# Altium schematic sheet Conectores.SchDoc
size A4
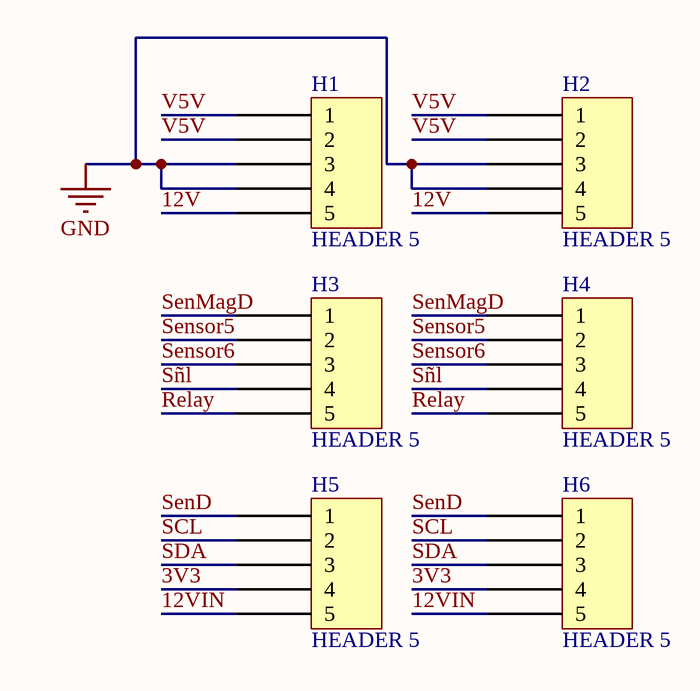
[diagram p0: Conectores.SchDoc]

## Parts
H1  HEADER 5  [HEADER5]
H2  HEADER 5  [HEADER5]
H3  HEADER 5  [HEADER5]
H4  HEADER 5  [HEADER5]
H5  HEADER 5  [HEADER5]
H6  HEADER 5  [HEADER5]

## Nets
GND: H1.3 H1.4 H2.3 H2.4
3V3: H5.4 H6.4
12V: H1.5 H2.5
12VIN: H5.5 H6.5
Relay: H3.5 H4.5
SCL: H5.2 H6.2
SDA: H5.3 H6.3
SenD: H5.1 H6.1
SenMagD: H3.1 H4.1
Sensor5: H3.2 H4.2
Sensor6: H3.3 H4.3
Sñl: H3.4 H4.4
V5V: H1.1 H1.2 H2.1 H2.2